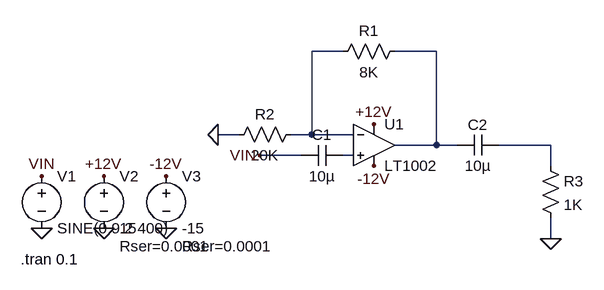
[diagram p0: schematic AmpNotInverted.asc]
AmpNotInverted.asc, the LTspice schematic file:
Version 4
SHEET 1 880 680
WIRE 288 32 240 32
WIRE 432 32 368 32
WIRE 128 160 96 160
WIRE 240 160 240 32
WIRE 240 160 208 160
WIRE 304 160 240 160
WIRE 432 176 432 32
WIRE 432 176 368 176
WIRE 464 176 432 176
WIRE 608 176 528 176
WIRE 224 192 160 192
WIRE 304 192 288 192
WIRE 608 208 608 176
WIRE 608 320 608 288
FLAG 16 304 0
FLAG -80 304 0
FLAG -176 304 0
FLAG 16 224 -12V
FLAG -80 224 +12V
FLAG 336 144 +12V
FLAG -176 224 VIN
FLAG 160 192 VIN
FLAG 336 208 -12V
FLAG 608 320 0
FLAG 96 160 0
SYMBOL Opamps\\LT1002 336 112 R0
SYMATTR InstName U1
SYMBOL voltage -176 208 R0
WINDOW 123 0 0 Left 2
WINDOW 39 0 0 Left 2
SYMATTR InstName V1
SYMATTR Value SINE(0 9.2 400)
SYMBOL voltage -80 208 R0
WINDOW 123 0 0 Left 2
WINDOW 39 24 124 Left 2
SYMATTR SpiceLine Rser=0.0001
SYMATTR InstName V2
SYMATTR Value 15
SYMBOL voltage 16 208 R0
WINDOW 123 0 0 Left 2
WINDOW 39 24 124 Left 2
SYMATTR SpiceLine Rser=0.0001
SYMATTR InstName V3
SYMATTR Value -15
SYMBOL res 272 48 R270
WINDOW 0 32 56 VTop 2
WINDOW 3 0 56 VBottom 2
SYMATTR InstName R1
SYMATTR Value 8K
SYMATTR SpiceLine tol=1 pwr=0.1
SYMBOL res 112 176 R270
WINDOW 0 32 56 VTop 2
WINDOW 3 0 56 VBottom 2
SYMATTR InstName R2
SYMATTR Value 20K
SYMATTR SpiceLine tol=1 pwr=0.1
SYMBOL cap 288 176 R90
WINDOW 0 0 32 VBottom 2
WINDOW 3 32 32 VTop 2
SYMATTR InstName C1
SYMATTR Value 10µ
SYMATTR SpiceLine V=25 Irms=8.64 Rser=0.0031053 Lser=0
SYMBOL res 592 192 R0
SYMATTR InstName R3
SYMATTR Value 1K
SYMATTR SpiceLine tol=1 pwr=0.1
SYMBOL cap 528 160 R90
WINDOW 0 0 32 VBottom 2
WINDOW 3 32 32 VTop 2
SYMATTR InstName C2
SYMATTR Value 10µ
SYMATTR SpiceLine V=25 Irms=8.64 Rser=0.0031053 Lser=0
TEXT -208 352 Left 2 !.tran 0.1

The netlist it stands for:
* AmpNotInverted.asc
XU1 N004 N001 +12V -12V N002 LT1002  ; pins In+ In- V+ V- OUT
V1 VIN 0 SINE(0 9.2 400)
V2 +12V 0 15 Rser=0.0001
V3 -12V 0 -15 Rser=0.0001
R1 N001 N002 8K tol=1 pwr=0.1
R2 0 N001 20K tol=1 pwr=0.1
C1 N004 VIN 10µ V=25 Irms=8.64 Rser=0.0031053 Lser=0
R3 N003 0 1K tol=1 pwr=0.1
C2 N003 N002 10µ V=25 Irms=8.64 Rser=0.0031053 Lser=0
.tran 0.1
.backanno
.end